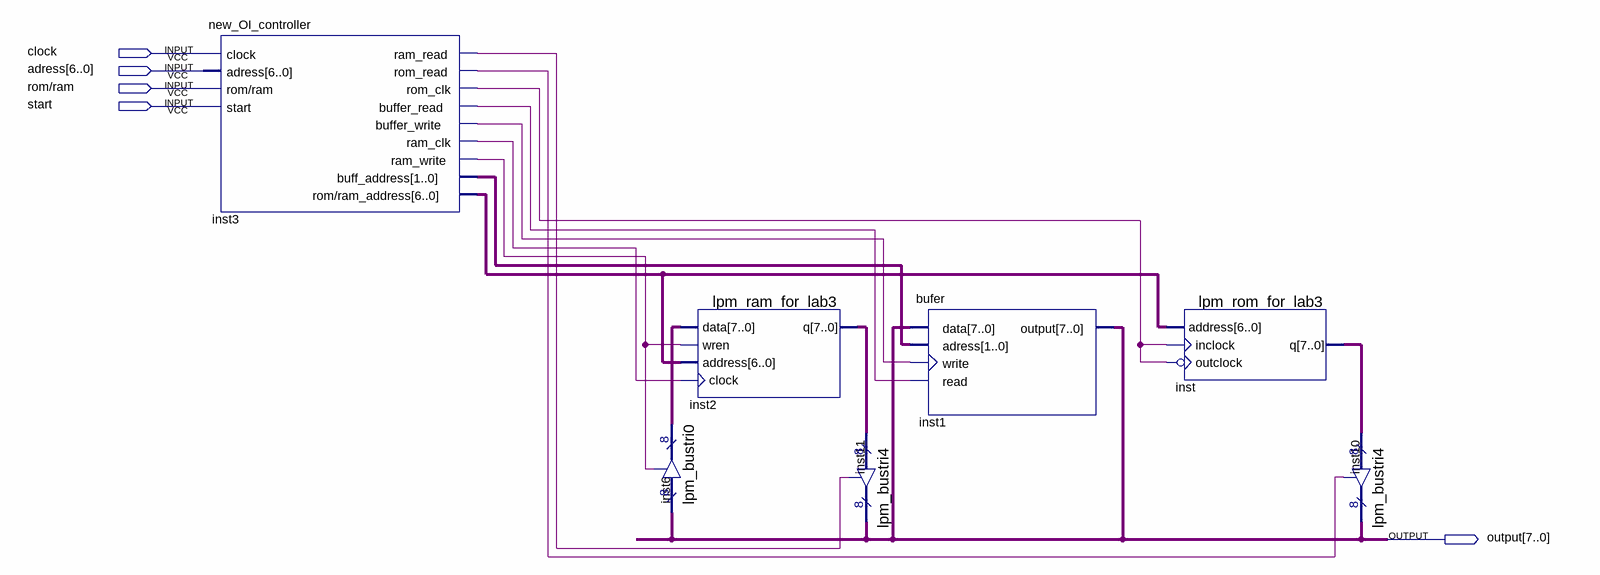
[diagram p0: schematic sheet]
// Quartus schematic Memory.bdf as structural Verilog: 7 symbols, 5 pins
module Memory (
  input  clock,
  input  [6:0] adress,
  input  \rom/ram ,
  input  start,
  output [7:0] \output 
);

  wire inst3_buffer_read, inst3_buffer_write, inst3_ram_clk, inst3_ram_read, inst3_ram_write, inst3_rom_clk,
       inst3_rom_read;
  wire [1:0] inst3_buff_address;
  wire [6:0] inst3_rom_ram_address;
  wire [7:0] inst2_q, inst6_tridata, inst_q;

  new_OI_controller inst3 (
    .clock(clock), .adress(adress), .\rom/ram (\rom/ram ), .start(start), .ram_read(inst3_ram_read),
    .rom_read(inst3_rom_read), .rom_clk(inst3_rom_clk), .buffer_read(inst3_buffer_read),
    .buffer_write(inst3_buffer_write), .ram_clk(inst3_ram_clk), .ram_write(inst3_ram_write),
    .buff_address(inst3_buff_address), .\rom/ram_address (inst3_rom_ram_address));
  lpm_ram_for_lab3 inst2 (
    .data(inst6_tridata), .wren(inst3_ram_write), .address(inst3_rom_ram_address), .clock(inst3_ram_clk),
    .q(inst2_q));
  lpm_bustri0 inst6 (.enabledt(inst3_ram_write), .data(\output ), .tridata(inst6_tridata));
  lpm_bustri4 inst11 (.enabledt(inst3_ram_read), .data(inst2_q), .tridata(\output ));
  bufer inst1 (
    .data(\output ), .adress(inst3_buff_address), .write(inst3_buffer_write), .read(inst3_buffer_read),
    .\output (\output ));
  lpm_rom_for_lab3 inst (
    .address(inst3_rom_ram_address), .inclock(inst3_rom_clk), .outclock(~inst3_rom_clk), .q(inst_q));
  lpm_bustri4 inst10 (.enabledt(inst3_rom_read), .data(inst_q), .tridata(\output ));
endmodule
